# EAGLE design CANx (EAGLE 6.5.0)
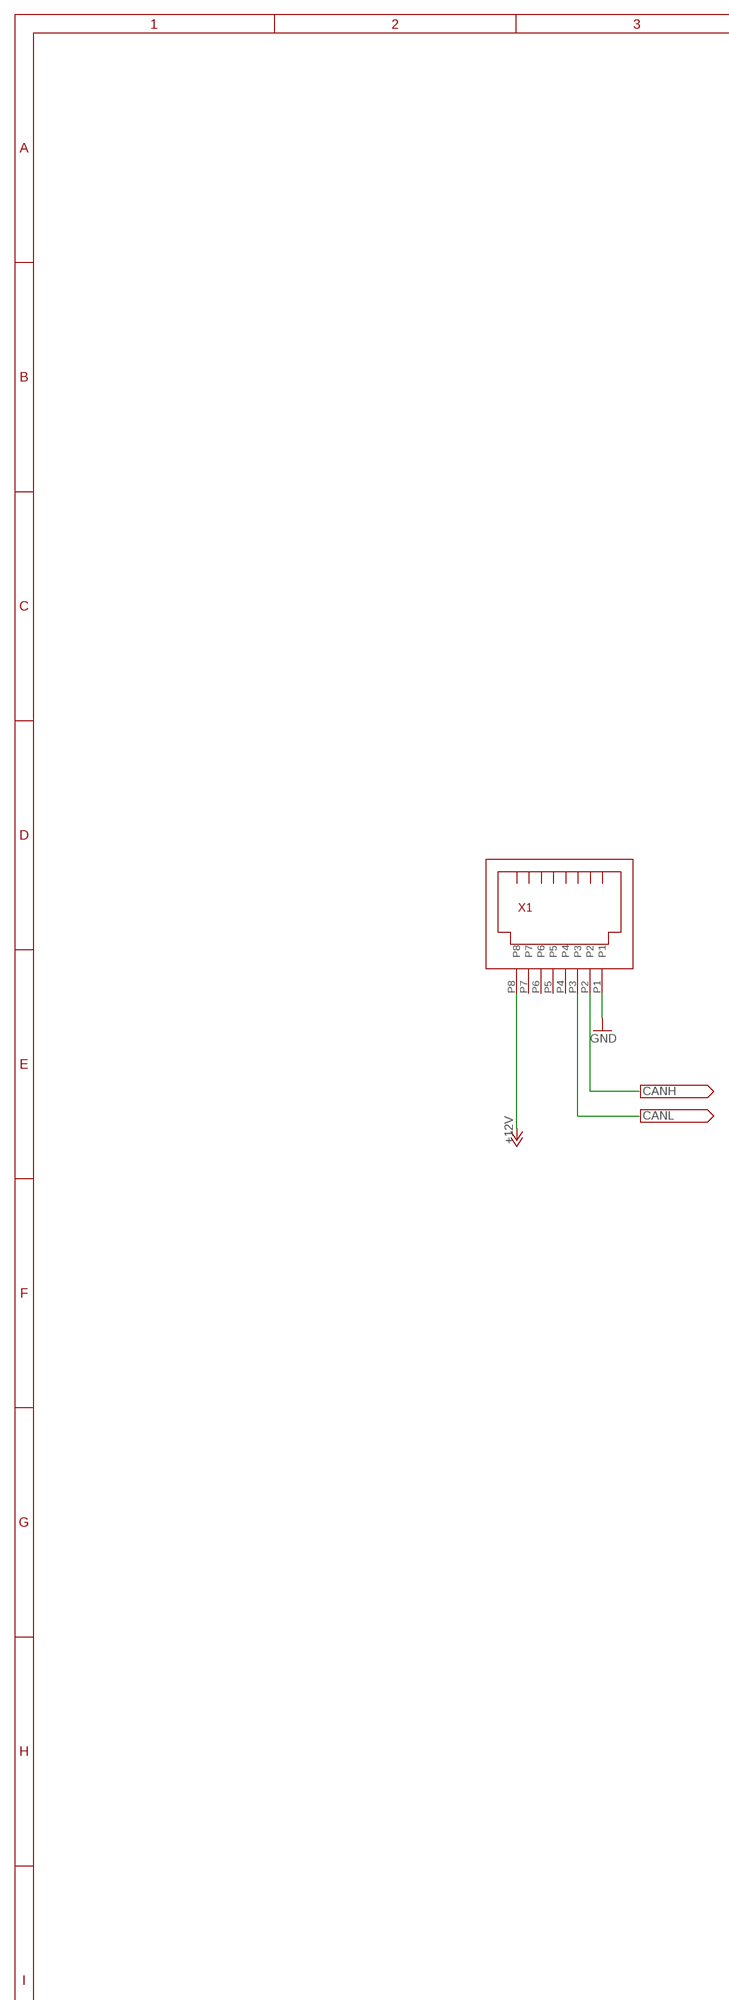
[diagram p0: schematic, sheet 1, part 1 of 2]
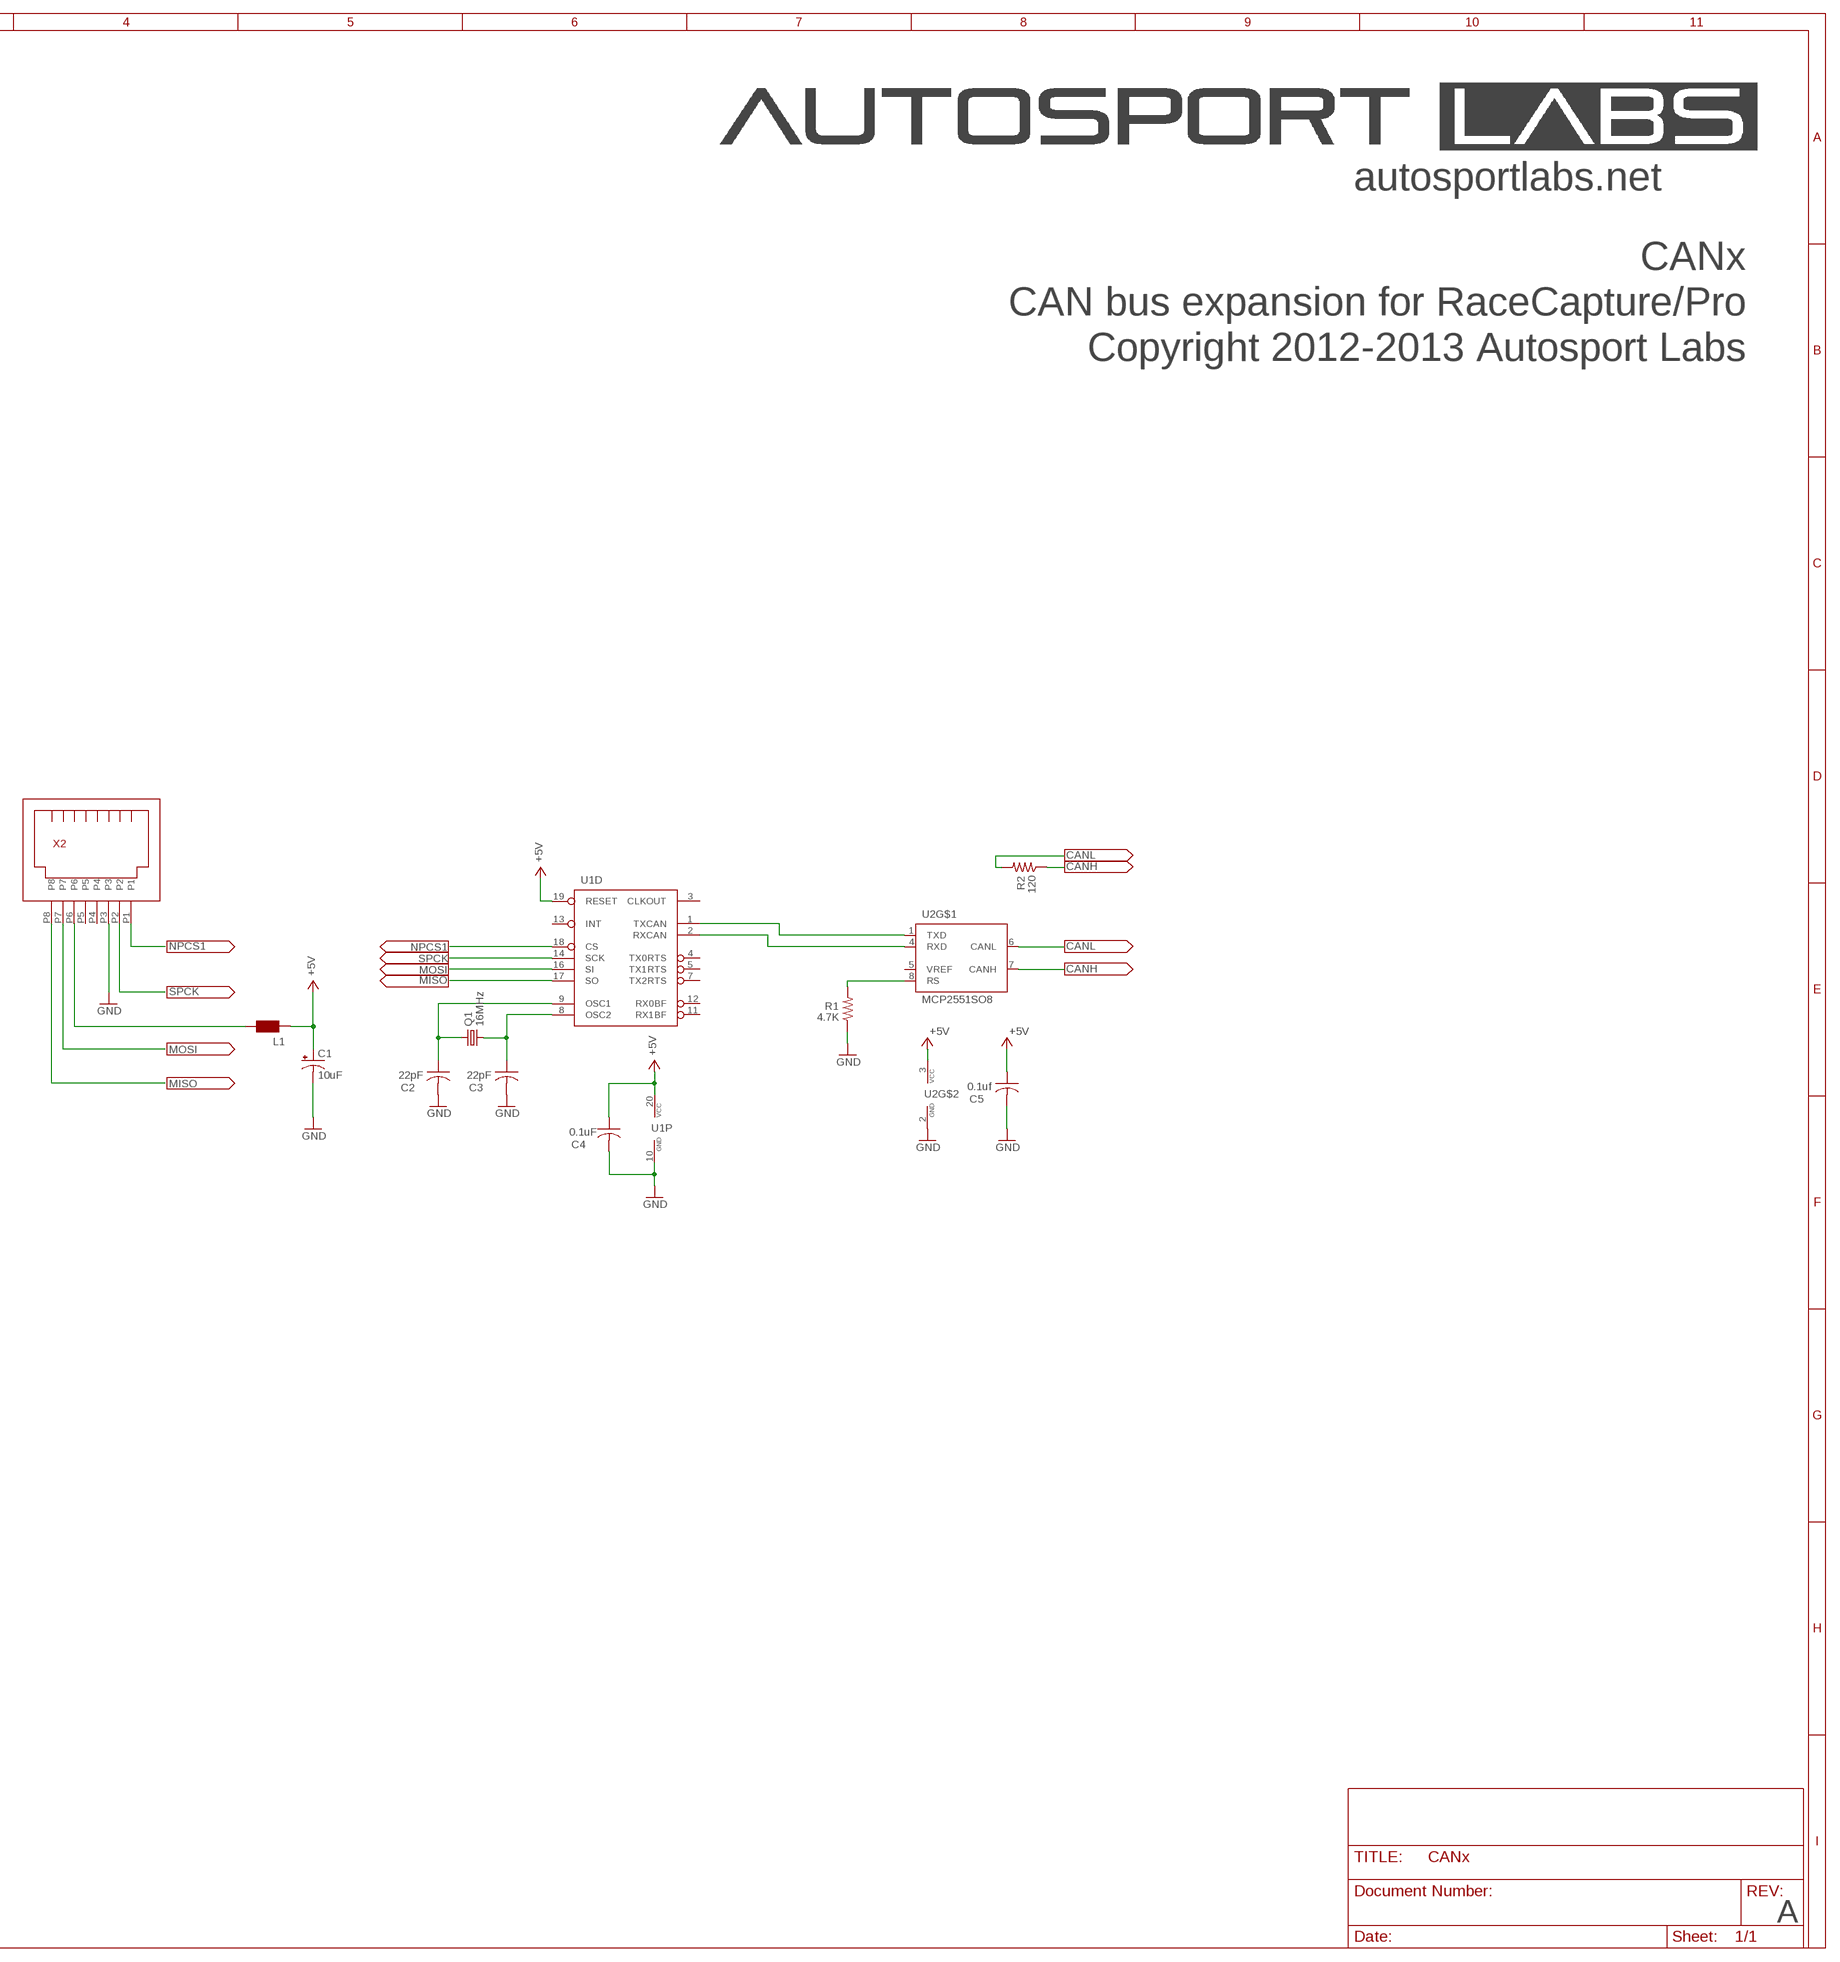
[diagram p1: schematic, sheet 1, part 2 of 2]

## Parts
C1  10uF  CPOL-USSMCD  [SMC_D]
C2  22pF  C-USC0603K  [C0603K]
C3  22pF  C-USC0603K  [C0603K]
C4  0.1uF  C-USC0603K  [C0603K]
C5  0.1uf  C-USC0603K  [C0603K]
L1  WE-CBF_1812  [1812]
Q1  16MHz  CRYSTAL5X3  [CRYSTAL-SMD-5X3]
R1  4.7K  R-US_R0603  [R0603]
R2  120  R-US_R0603  [R0603]
U1  MCP2515ST  [TSSOP20]
U2  MCP2551SO8  [SO08]
X1  RJ45_RIGHT_ANGLEMOLEX_95001-2881  [RJ45_RIGHT_ANGLE_MOLEX_95001-2881]
X2  RJ45_RIGHT_ANGLEMOLEX_95001-2881  [RJ45_RIGHT_ANGLE_MOLEX_95001-2881]

## Nets
+5V: C1.+ C4.1 C5.1 L1.1 U1.19(D:RESET) U1.20(P:VCC) U2.3(VCC)
+12V: X1.P8
CAN1_RX: U1.2(D:RXCAN) U2.4(RXD)
CAN1_TX: U1.1(D:TXCAN) U2.1(TXD)
CANH: R2.1 U2.7(CANH) X1.P2
CANL: R2.2 U2.6(CANL) X1.P3
GND: C1.- C2.2 C3.2 C4.2 C5.2 R1.1 U1.10(P:GND) U2.2(GND) X1.P1 X2.P3
MISO: U1.17(D:SO) X2.P8
MOSI: U1.16(D:SI) X2.P7
N$1: C2.1 Q1.3 U1.9(D:OSC1)
N$2: C3.1 Q1.1 U1.8(D:OSC2)
N$4: L1.2 X2.P6
N$34: R1.2 U2.8(RS)
NPCS1: U1.18(D:CS) X2.P1
SPCK: U1.14(D:SCK) X2.P2
Unconnected: U1.3(D:CLKOUT) U1.4(D:TX0RTS) U1.5(D:TX1RTS) U1.7(D:TX2RTS) U1.11(D:RX1BF) U1.12(D:RX0BF) U1.13(D:INT) U2.5(VREF) X1.P4 X1.P5 X1.P6 X1.P7 X2.P4 X2.P5

## Notes on the sheet
- autosportlabs.net
- CANx
- CAN bus expansion for RaceCapture/Pro
- Copyright 2012-2013 Autosport Labs
- A

## Library data of the parts
C1 = rcl:CPOL-US: POLARIZED CAPACITOR, American symbol
C2-C5 = rcl:C-US: CAPACITOR, American symbol
L1 = wuerth-elektronik:WE-CBF: SMD EMI Suppression Ferrite Beads - excellent anti-EMI properties - low DCR - impedances till 3000 ohms - rated current up to 6 A
Q1 = SparkFun:CRYSTAL: Crystals Various standard crystals. Proven footprints. Spark Fun Electronics SKU : COM-00534
R1 R2 = rcl:R-US_: RESISTOR, American symbol
U1 = can:MCP2515: MC2515 Stand-Alone CAN Controller With SPI Interface, Microchip
U2 = can:MCP2551: CAN Tranceiver Microchip
X1 X2 = FCI_RJ12:RJ45_RIGHT_ANGLE

## Board
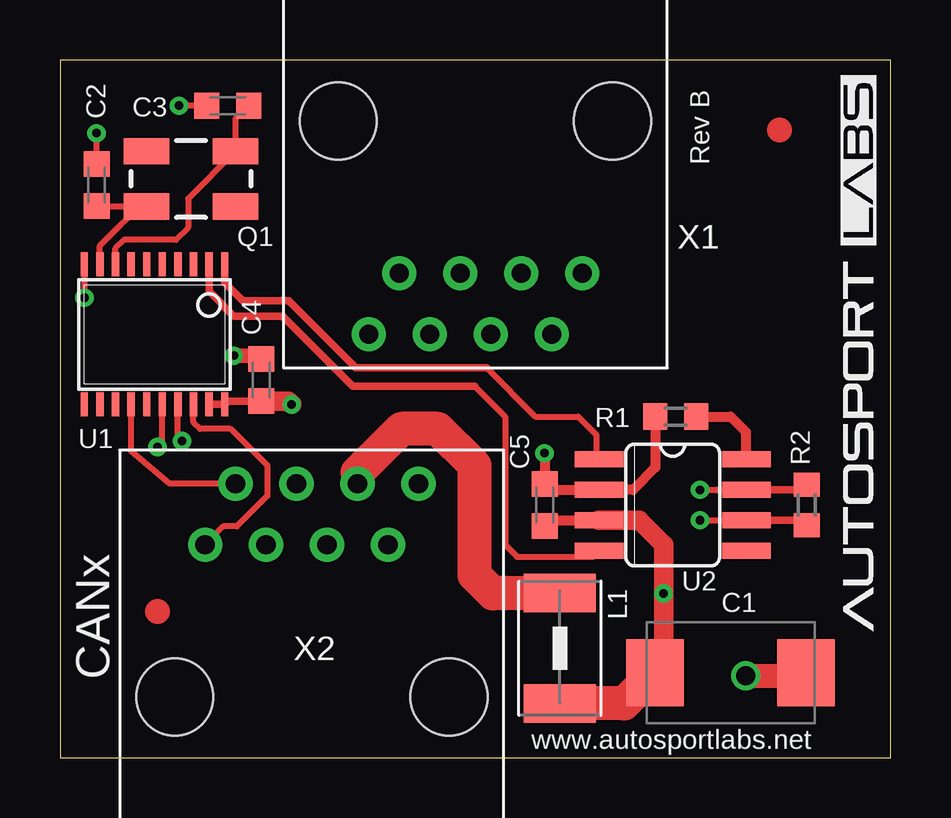
[diagram p2: board, top side]
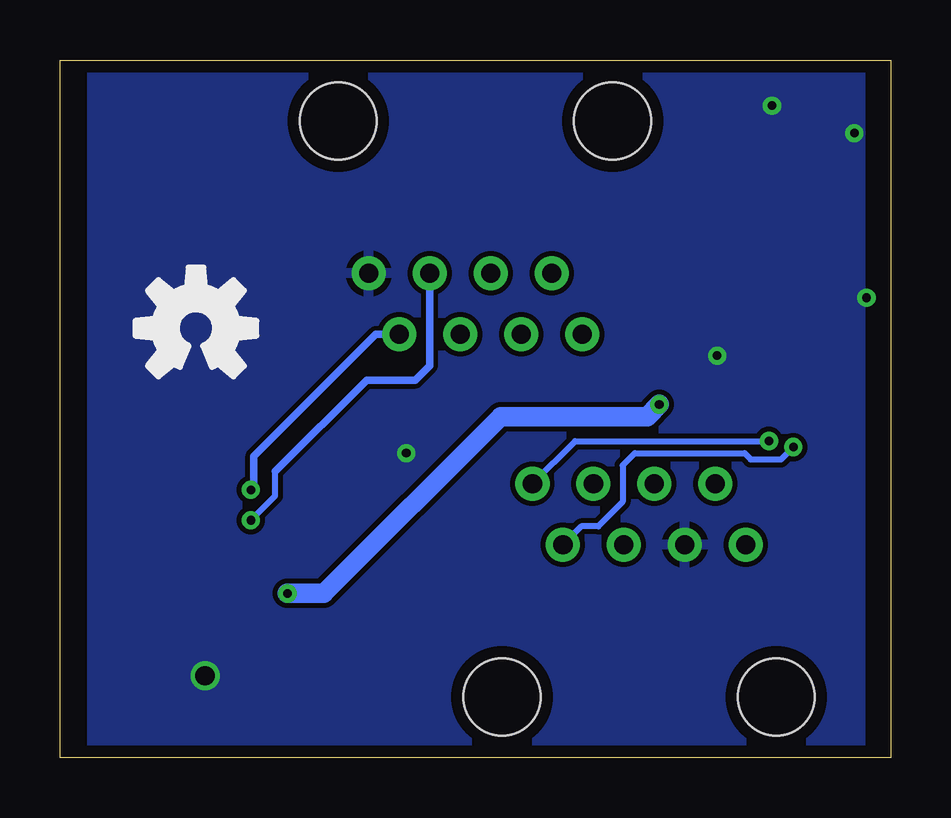
[diagram p3: board, bottom side, seen from below]

Size 34.62 x 29.08 mm. Coordinates in mm from the lower left corner, seen from the top.
Outline: 0,0 34.62,0 34.62,29.08 0,29.08 0,0
Copper layers (1*16): Top 0.035mm / dielectric 1.5mm / Bottom 0.035mm
Design rules "default *": minimum track width 10mil, minimum drill 14mil, track to track 8mil, track to pad 8mil, pad to pad 8mil, via to via 8mil, smd to smd 8mil, copper to edge 20mil, drill to drill 8mil, minimum pad ring 10mil, minimum via ring 8mil, stop-mask expansion 4mil, vias tented up to drill 20mil, thermal gap 10mil

### Footprints (pad centres in the part's own frame; a part is rotated, then mirrored left to right if it is on the bottom)
SMC_D = smd 2.4 x 2.8: + -3.15,0; - 3.15,0
C0603K = smd 1.05 x 1.08: 1 -0.875,0; 2 0.875,0
1812 = smd 1.6 x 3: 1 -2.3,0; 2 2.3,0
CRYSTAL-SMD-5X3 = smd 1.9 x 1.1: 1 -1.85,-1.15; 2 1.85,-1.15; 3 1.85,1.15; 4 -1.85,1.15
R0603 = smd 1 x 1.1: 1 -0.85,0; 2 0.85,0
TSSOP20 = smd 0.305 x 0.991: 1 -2.925,-2.918; 2 -2.275,-2.918; 3 -1.625,-2.918; 4 -0.975,-2.918; 5 -0.325,-2.918; 6 0.325,-2.918; 7 0.975,-2.918; 8 1.625,-2.918; 9 2.275,-2.918; 10 2.925,-2.918; 11 2.925,2.918; 12 2.275,2.918; 13 1.625,2.918; 14 0.975,2.918; 15 0.325,2.918; 16 -0.325,2.918; 17 -0.975,2.918; 18 -1.625,2.918; 19 -2.275,2.918; 20 -2.925,2.918
SO08 = smd 0.66 x 2.032: 1 -1.905,-3.073; 2 -0.635,-3.073; 3 0.635,-3.073; 4 1.905,-3.073; 5 1.905,3.073; 6 0.635,3.073; 7 -0.635,3.073; 8 -1.905,3.073
RJ45_RIGHT_ANGLE_MOLEX_95001-2881 = drill 0.8 pad 1.422: P1 -4.445,6.35; P2 -3.175,8.89; P3 -1.905,6.35; P4 -0.635,8.89; P5 0.635,6.35; P6 1.905,8.89; P7 3.175,6.35; P8 4.445,8.89 | hole 3.2: -5.715,0; 5.715,0

### Placement (x,y rotation side)
C1  27.94,3.56 0 top
C2  1.52,23.88 90 top
C3  6.99,27.18 180 top
C4  8.38,15.75 90 top
C5  20.19,10.54 90 top
L1  20.83,4.57 90 top
Q1  5.46,24.13 180 top
R1  25.65,14.22 0 top
R2  31.11,10.54 270 top
U1  3.94,17.65 180 top
U2  25.53,10.54 270 top
X1  17.31,26.54 180 top
X2  10.49,2.54 0 top

### Tracks (layer width: path | path; a pad name or v marks a point on that pad's centre or on a via)
+5V  (via drill 0.36)
  Top 0.254: 25.15,3.81 24.89,3.56 C1.+
  Top 0.305: C4.1 7,14.87 U1.20 U1.19
  Top 0.406: C5.1 20.19,9.91 U2.3
  Top 0.813: U2.3 24.13,9.91 25.15,8.89 v25.15,6.86 25.15,3.81 | C4.1 9.51,14.87 v9.65,14.73
  Top 1.422: C1.+ 23.51,2.27 L1.1
  Bottom 0.813: v25.15,6.86 23.62,6.86 16.26,14.22 10.16,14.22 v9.65,14.73
CAN1_RX
  Top 0.254: U2.4 22.2,8.38 19.05,8.38 18.54,8.89 18.54,14.22 17.27,15.49
  Top 0.305: 17.27,15.49 12.19,15.49 9.27,18.41 8,18.41 7.24,18.41 6.21,19.44 U1.2
CAN1_TX
  Top 0.254: U2.1 22.35,12.55 22.35,13.46 21.59,14.22 19.81,14.22 17.78,16.26
  Top 0.305: 17.78,16.26 12.32,16.26 9.53,19.05 7.62,19.05 6.86,19.81 U1.1
CANH  (via drill 0.36)
  Top 0.254: v26.67,11.18 U2.7
  Top 0.305: U2.7 31.41,11.18
  Top 0.406: 31.41,11.18 R2.1 31.24,11.39
  Bottom 0.305: v26.67,11.18 26.54,11.3 26.54,12.57 21.46,17.65 X1.P2
CANL  (via drill 0.36)
  Top 0.254: v26.67,9.91 29.21,9.91
  Top 0.305: U2.6 29.21,9.91 31.08,9.91 31.41,9.91
  Top 0.406: 31.41,9.91 R2.2 31.08,9.91
  Bottom 0.254: v26.67,9.91 25.65,10.92 25.65,11.94
  Bottom 0.305: 25.65,11.94 21.84,15.75 19.81,15.75 19.21,16.34 X1.P3
GND  (via drill 0.36, 0.8)
  Top 0.254: C2.2 v1.52,26.04 | C3.2 v4.95,27.18 | U1.10 v1.01,19.18 v1.02,19.18
  Top 0.406: v20.19,12.7 C5.2 20.19,11.18 U2.2 23.88,11.18 24.8,12.1 R1.1
  Top 0.61: v7.24,16.76 8.27,16.76 C4.2
  Top 1.016: C1.- 30.35,3.4 v28.57,3.43
  pour Bottom: 1.27,0.51 33.27,0.51 33.27,28.7 1.27,28.7
MISO  (via drill 0.36)
  Top 0.254: U1.17 4.91,13.38 v5.08,13.21
  Bottom 0.254: X2.P8 13.16,13.21 v5.08,13.21
MOSI  (via drill 0.36)
  Top 0.254: v4.06,12.95 4.26,13.15 U1.16
  Bottom 0.254: X2.P7 12.9,9.65 12.19,9.65 11.18,10.67 11.18,12.19 10.67,12.7 6.1,12.7 5.84,12.45 4.57,12.45 v4.06,12.95
N$1
  Top 0.254: C2.1 1.54,22.98 Q1.3 3.11,22.73 2.54,22.23 1.66,21.35 U1.9
N$2
  Top 0.254: C3.1 7.31,26.63 Q1.1 5.33,23.3 5.33,22.1 4.83,21.59 2.67,21.59 2.31,21.23 U1.8
N$4
  Top 1.27: 12.39,11.89 X2.P6
  Top 1.422: L1.2 20.81,6.86 18.03,6.86 17.27,7.62 17.27,12.19 15.75,13.72 14.22,13.72 12.39,11.89
N$34
  Top 0.406: R1.2 27.94,14.22 28.57,13.59 28.57,12.47 U2.8
NPCS1
  Top 0.254: U1.18 5.56,14 5.84,13.72 7.11,13.72 8.64,12.19 8.64,10.92 7.37,9.65 6.81,9.65 X2.P1
SPCK
  Top 0.254: X2.P2 4.57,11.43 2.96,12.79 U1.14
(copper drawn outside any net)
  shapes: Top circle x2

### Text on the board
tPlace: Rev B | CANx | www.autosportlabs.net